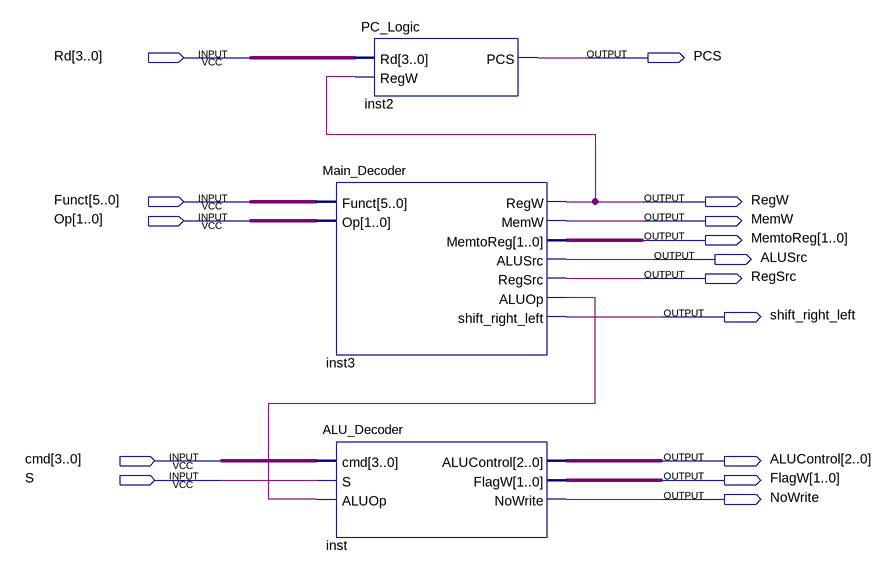
[diagram p0: schematic sheet]
// Quartus schematic Combined_Decoder.bdf as structural Verilog: 3 symbols, 15 pins
module Combined_Decoder (
  input  [3:0] Rd,
  input  [5:0] Funct,
  input  [1:0] Op,
  input  [3:0] cmd,
  input  S,
  output PCS,
  output RegW,
  output MemW,
  output [1:0] MemtoReg,
  output ALUSrc,
  output RegSrc,
  output shift_right_left,
  output [2:0] ALUControl,
  output [1:0] FlagW,
  output NoWrite
);

  wire inst3_aluop;

  PC_Logic inst2 (.Rd(Rd), .RegW(RegW), .PCS(PCS));
  Main_Decoder inst3 (
    .Funct(Funct), .Op(Op), .RegW(RegW), .MemW(MemW), .MemtoReg(MemtoReg), .ALUSrc(ALUSrc), .RegSrc(RegSrc),
    .ALUOp(inst3_aluop), .shift_right_left(shift_right_left));
  ALU_Decoder inst (.cmd(cmd), .S(S), .ALUOp(inst3_aluop), .ALUControl(ALUControl), .FlagW(FlagW), .NoWrite(NoWrite));
endmodule
